# EAGLE schematic customNE555SMD (EAGLE 7.6.0)
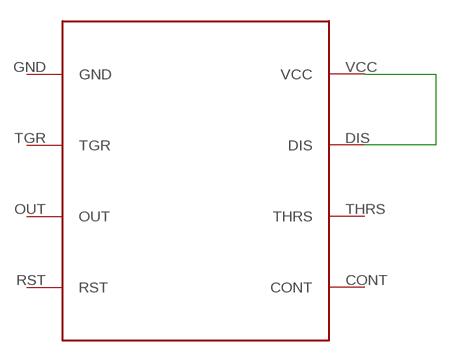
[diagram p0: schematic, sheet 1]

## Parts
U$1  NE555SMD  [NE555SMD]

## Nets
N$1: U$1.DIS U$1.VCC
Unconnected: U$1.CONT U$1.GND U$1.OUT U$1.RST U$1.TGR U$1.THRS

## Library data of the parts
U$1 = NE555SMD:NE555SMD